# Altium schematic sheet CommandGen.SchDoc
size A
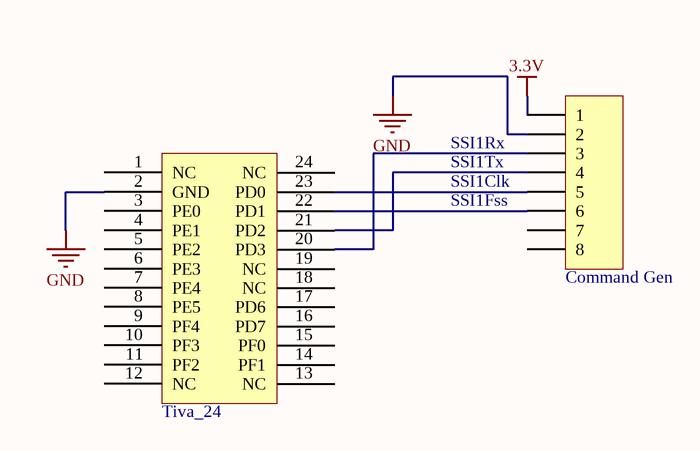
[diagram p0: CommandGen.SchDoc]

## Parts
*  Tiva_24
P?  Command Gen  [HDR1X8H]

## Nets
3.3V: P?.1
GND: *.2(GND) P?.2
Net*_20: *.20(PD3) P?.3
Net*_21: *.21(PD2) P?.4
Net*_22: *.22(PD1) P?.6
Net*_23: *.23(PD0) P?.5

Not connected (* = marked no-connect by the designer): * 1(NC) 3(PE0) 4(PE1) 5(PE2) 6(PE3) 7(PE4) 8(PE5) 9(PF4) 10(PF3) 11(PF2) 12(NC) 13(NC) 14(PF1) 15(PF0) 16(PD7) 17(PD6) 18(NC) 19(NC) 24(NC); P? 7 8

## Notes on the sheet
- (near P?) SSI1Rx
- (near P?) SSI1Tx
- (near P?) SSI1Fss
- (near P?) SSI1Clk

## Library data of the parts
* = Tiva_24: Tiva Protection 24 Pin Connector
P? = Header 8H: Header, 8-Pin, Right Angle; LatestRevisionDate: 17-Jul-2002; LatestRevisionNote: Re-released for DXP Platform.; Publisher: Altium Limited